# EAGLE design sc88_sampler (EAGLE 9.2.2)
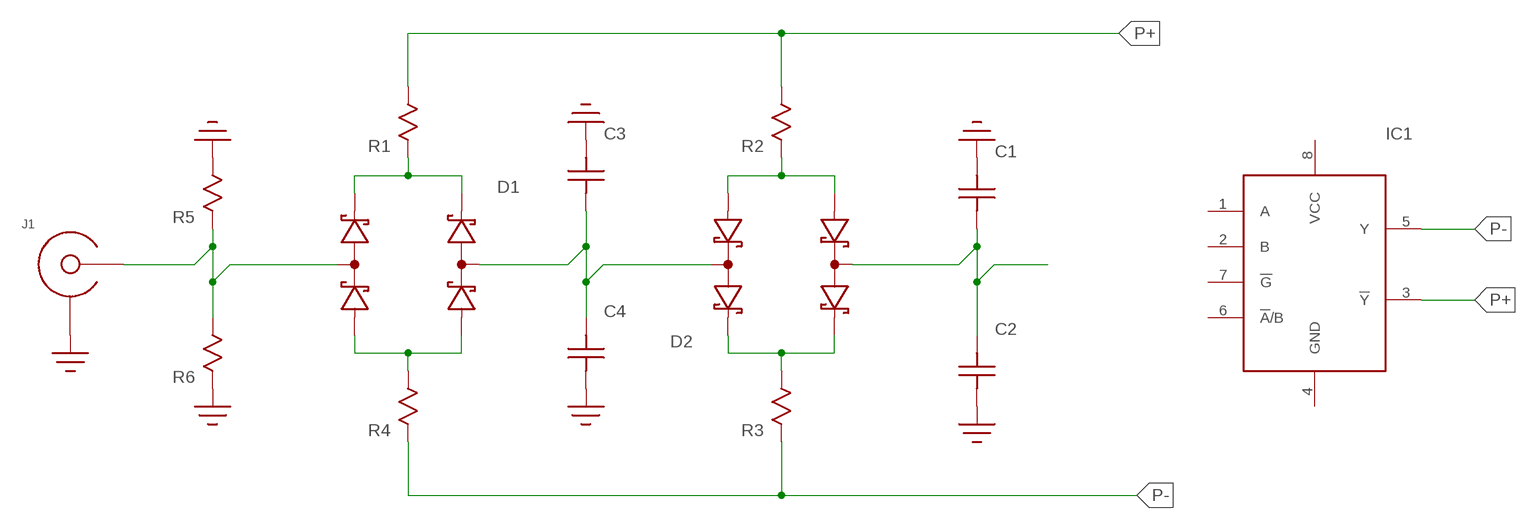
[diagram p0: schematic, sheet 1]

## Parts
C1  C  [C0402]
C2  C  [C0402]
C3  C  [C0402]
C4  C  [C0402]
D1  SMS3923-081  [SC-88]
D2  SMS3923-081  [SC-88]
IC1  74LVC2G157  [SSOP8]
J1  EDGE_LAUNCH_JACK  [EDGE_LAUNCH_RF_CON]
R1  R0402  [0402]
R2  R0402  [0402]
R3  R0402  [0402]
R4  R0402  [0402]
R5  R0402  [0402]
R6  R0402  [0402]

## Nets
GND: C1.2 C2.1 C3.2 C4.1 J1.GND@1(SHIELD) J1.GND@2(SHIELD) J1.GND@3(SHIELD) J1.GND@4(SHIELD) J1.GND@5(SHIELD) J1.GND@6(SHIELD) J1.GND@7(SHIELD) J1.GND@8(SHIELD) J1.GND@9(SHIELD) J1.GND@10(SHIELD) J1.GND@11(SHIELD) J1.GND@12(SHIELD) J1.SHIELD@1(SHIELD) J1.SHIELD@2(SHIELD) R5.2 R6.1
N$1: D1.5(COMMON1) J1.CENTER R5.1 R6.2
N$3: D1.1(ANODE0) D1.6(ANODE1) R4.2
N$4: D1.3(CATHODE0) D1.4(CATHODE1) R1.1
N$5: C1.1 C2.2 D2.5(COMMON1)
N$6: D2.1(ANODE0) D2.6(ANODE1) R2.1
N$7: D2.3(CATHODE0) D2.4(CATHODE1) R3.2
N$8: C3.1 C4.2 D1.2(COMMON0) D2.2(COMMON0)
P+: IC1.3(!Y!) R1.2 R2.2
P-: IC1.5(Y) R3.1 R4.1
Unconnected: IC1.1(A) IC1.2(B) IC1.4(GND) IC1.6(!A!/B) IC1.7(!G!) IC1.8(VCC)

## Library data of the parts
C1-C4 = yapo:C
D1 D2 = yapo:SMS3923-081
IC1 = yapo:74LVC2G157
J1 = yapo:EDGE_LAUNCH_JACK
R1-R6 = yapo:R

## Board
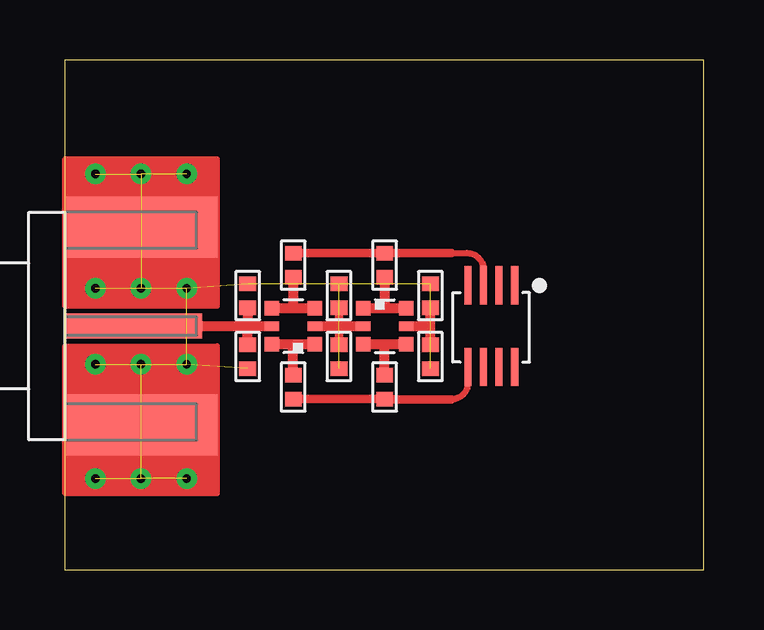
[diagram p1: board, top side]
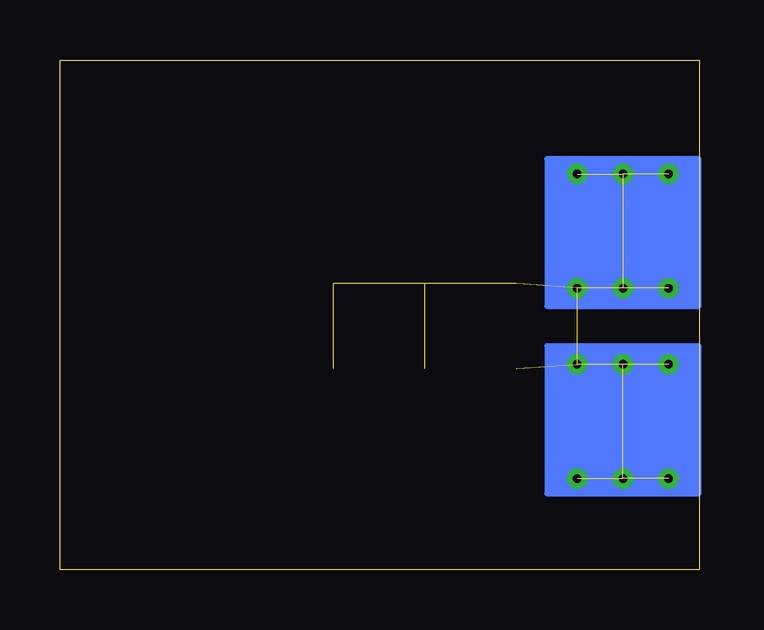
[diagram p2: board, bottom side, seen from below]

Size 26.65 x 21.26 mm. Coordinates in mm from the lower left corner, seen from the top.
Outline: 0,0 26.65,0 26.65,21.26 0,21.26 0,0
Copper layers (1*16): Top 0.035mm / dielectric 1.5mm / Bottom 0.035mm
Design rules "default": minimum track width 6mil, minimum drill 0.35mm, track to track 6mil, track to pad 6mil, pad to pad 6mil, via to via 6mil, smd to smd 6mil, copper to edge 40mil, drill to drill 6mil, minimum pad ring 10mil, minimum via ring 8mil, stop-mask expansion 4mil, vias tented up to drill 0mil, thermal gap 10mil

### Footprints (pad centres in the part's own frame; a part is rotated, then mirrored left to right if it is on the bottom)
C0402 = smd 0.6 x 0.7: 1 -0.5,0; 2 0.5,0
SC-88 = smd 0.6 x 0.6: 1 -0.9,0.75; 3 -0.9,-0.75; 4 0.9,-0.75; 6 0.9,0.75 | smd 0.6 x 0.4: 2 -0.9,0; 5 0.9,0
SSOP8 = smd 0.3 x 1.6: 1 -0.975,-1.7; 2 -0.325,-1.7; 3 0.325,-1.7; 4 0.975,-1.7; 5 0.975,1.7; 6 0.325,1.7; 7 -0.325,1.7; 8 -0.975,1.7
EDGE_LAUNCH_RF_CON = smd 5.715 x 1.041: CENTER -2.875,0 | drill 0.35: GND@1 -5.08,1.587; GND@2 -3.175,1.587; GND@3 -1.27,1.587; GND@4 -5.08,-1.587; GND@5 -3.175,-1.587; GND@6 -1.27,-1.587; GND@7 -5.08,6.35; GND@8 -3.175,6.35; GND@9 -1.27,6.35; GND@10 -5.08,-6.35; GND@11 -3.175,-6.35; GND@12 -1.27,-6.35 | smd 6.35 x 2.54: SHIELD@1 -3.175,-4.128; SHIELD@2 -3.175,4.128
0402 = smd 0.6 x 0.7: 1 -0.5,0; 2 0.5,0

### Placement (x,y rotation side)
C1  15.24,11.43 90 top
C2  15.24,8.89 90 top
C3  11.43,11.43 90 top
C4  11.43,8.89 90 top
D1  9.53,10.16 180 top
D2  13.34,10.16 0 top
IC1  17.78,10.16 180 top
J1  0,10.16 180 top
R1  9.53,12.7 90 top
R2  13.34,12.7 90 top
R3  13.34,7.62 90 top
R4  9.53,7.62 90 top
R5  7.62,8.89 270 top
R6  7.62,11.43 270 top

### Tracks (layer width: path | path; a pad name or v marks a point on that pad's centre or on a via)
GND  (19 unrouted)
N$1
  Top 0.406: J1.CENTER 7.62,10.16 | 7.62,10.16 D1.5 | R6.2 7.62,10.16 | R5.1 7.62,10.16
N$3
  Top 0.406: D1.6 9.53,9.41 | 9.53,9.41 D1.1 | R4.2 9.53,9.41
N$4
  Top 0.406: D1.4 9.53,10.91 | 9.53,10.91 D1.3 | R1.1 9.53,10.91
N$5
  Top 0.406: D2.5 15.24,10.16 | 15.24,10.16 C1.1 | C2.2 15.24,10.16
N$6
  Top 0.406: D2.1 13.34,10.91 | 13.34,10.91 D2.6 | R2.1 13.34,10.91
N$7
  Top 0.406: D2.3 13.34,9.41 | 13.34,9.41 D2.4 | R3.2 13.34,9.41
N$8
  Top 0.356: C3.1 11.43,10.16 C4.2
  Top 0.406: D1.2 11.43,10.16 D2.2
P+
  Top 0.254: IC1.3 17.45,12.52 arc90 16.76,13.21 16.13,13.21
  Top 0.356: R1.2 R2.2 arc-90 R2.2 16.13,13.21
P-
  Top 0.254: IC1.5 16.8,7.79 arc-90 16.13,7.11
  Top 0.356: R4.1 R3.1 arc90 R3.1 16.13,7.11